# Altium schematic sheet DBL TLC5940 driver for High load - 5.3A MOSFET.SchDoc: DBL TLC5940 driver for High load - 5.3A MOSFET
size A4; Revision: 0; SheetNumber: 2; SheetTotal: 2; Version: 1.0; Variant: 5.3 A MOSFET; Modification: Mod; Project: Light Control
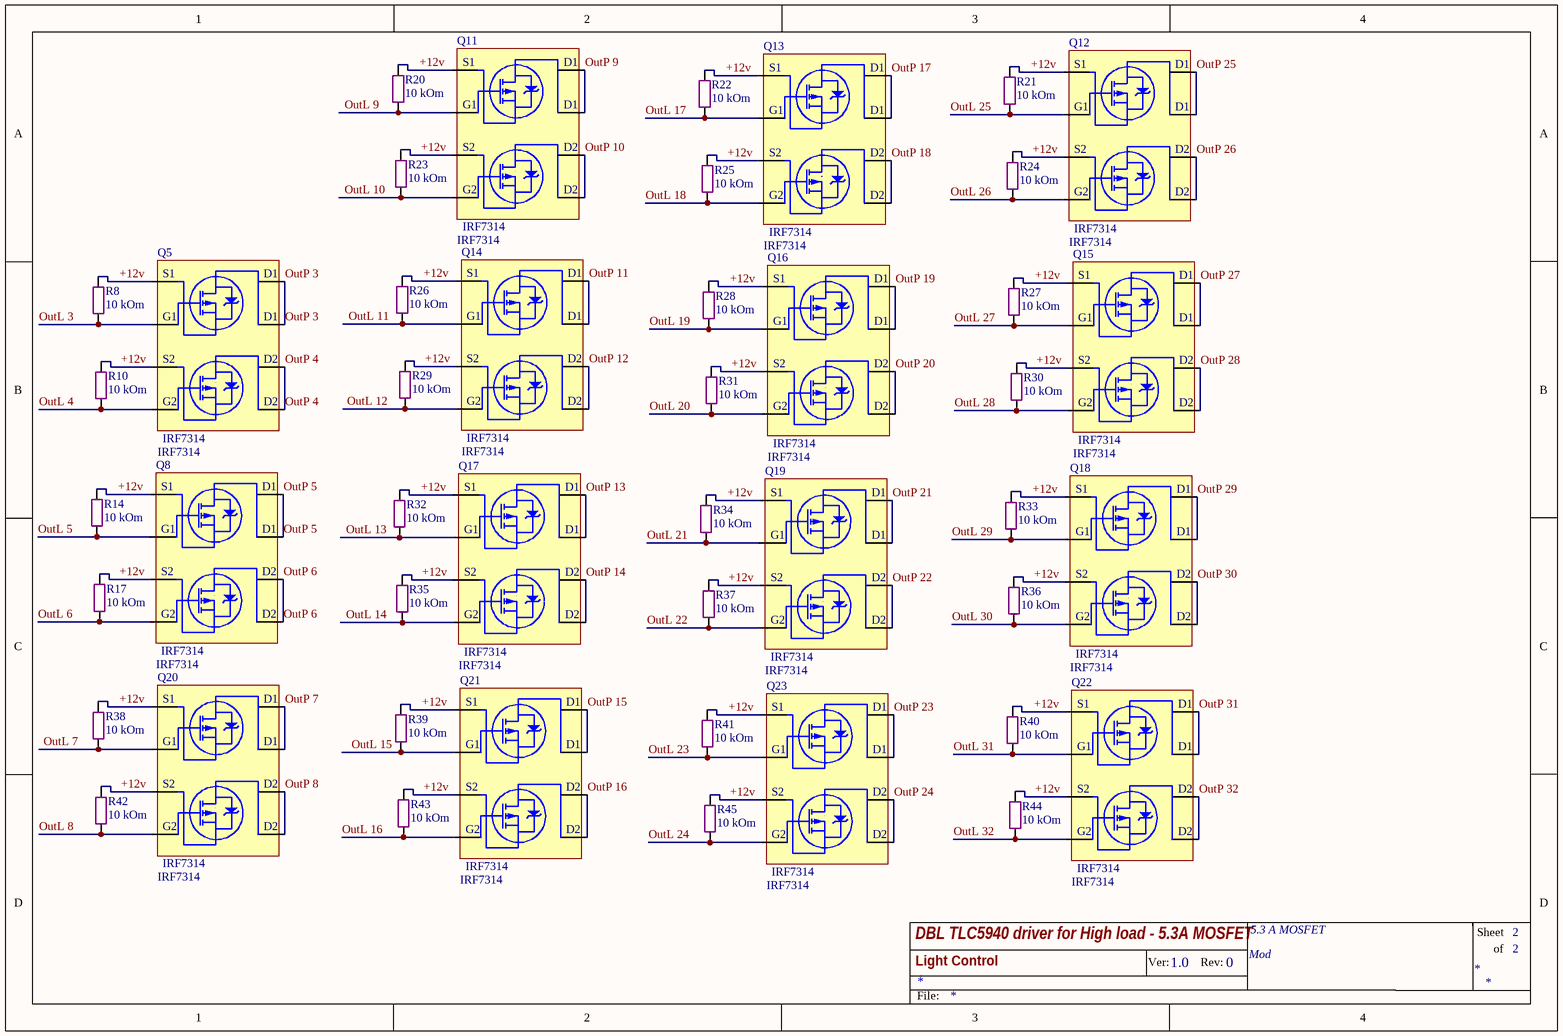
[diagram p0: DBL TLC5940 driver for High load - 5.3A MOSFET.SchDoc]

## Parts
Q5  IRF7314  [SO8]
Q8  IRF7314  [SO8]
Q11  IRF7314  [SO8]
Q12  IRF7314  [SO8]
Q13  IRF7314  [SO8]
Q14  IRF7314  [SO8]
Q15  IRF7314  [SO8]
Q16  IRF7314  [SO8]
Q17  IRF7314  [SO8]
Q18  IRF7314  [SO8]
Q19  IRF7314  [SO8]
Q20  IRF7314  [SO8]
Q21  IRF7314  [SO8]
Q22  IRF7314  [SO8]
Q23  IRF7314  [SO8]
R8  10 kOm  [SMD 0805 (2012)]
R10  10 kOm  [SMD 0805 (2012)]
R14  10 kOm  [SMD 0805 (2012)]
R17  10 kOm  [SMD 0805 (2012)]
R20  10 kOm  [SMD 0805 (2012)]
R21  10 kOm  [SMD 0805 (2012)]
R22  10 kOm  [SMD 0805 (2012)]
R23  10 kOm  [SMD 0805 (2012)]
R24  10 kOm  [SMD 0805 (2012)]
R25  10 kOm  [SMD 0805 (2012)]
R26  10 kOm  [SMD 0805 (2012)]
R27  10 kOm  [SMD 0805 (2012)]
R28  10 kOm  [SMD 0805 (2012)]
R29  10 kOm  [SMD 0805 (2012)]
R30  10 kOm  [SMD 0805 (2012)]
R31  10 kOm  [SMD 0805 (2012)]
R32  10 kOm  [SMD 0805 (2012)]
R33  10 kOm  [SMD 0805 (2012)]
R34  10 kOm  [SMD 0805 (2012)]
R35  10 kOm  [SMD 0805 (2012)]
R36  10 kOm  [SMD 0805 (2012)]
R37  10 kOm  [SMD 0805 (2012)]
R38  10 kOm  [SMD 0805 (2012)]
R39  10 kOm  [SMD 0805 (2012)]
R40  10 kOm  [SMD 0805 (2012)]
R41  10 kOm  [SMD 0805 (2012)]
R42  10 kOm  [SMD 0805 (2012)]
R43  10 kOm  [SMD 0805 (2012)]
R44  10 kOm  [SMD 0805 (2012)]
R45  10 kOm  [SMD 0805 (2012)]

## Nets
+12v: Q5.1(S) Q5.3(S) Q8.1(S) Q8.3(S) Q11.1(S) Q11.3(S) Q12.1(S) Q12.3(S) Q13.1(S) Q13.3(S) Q14.1(S) Q14.3(S) Q15.1(S) Q15.3(S) Q16.1(S) Q16.3(S) Q17.1(S) Q17.3(S) Q18.1(S) Q18.3(S) Q19.1(S) Q19.3(S) Q20.1(S) Q20.3(S) Q21.1(S) Q21.3(S) Q22.1(S) Q22.3(S) Q23.1(S) Q23.3(S) R8.2 R10.2 R14.2 R17.2 R20.2 R21.2 R22.2 R23.2 R24.2 R25.2 R26.2 R27.2 R28.2 R29.2 R30.2 R31.2 R32.2 R33.2 R34.2 R35.2 R36.2 R37.2 R38.2 R39.2 R40.2 R41.2 R42.2 R43.2 R44.2 R45.2
OutL 3: Q5.2(G) R8.1
OutL 4: Q5.4(G) R10.1
OutL 5: Q8.2(G) R14.1
OutL 6: Q8.4(G) R17.1
OutL 7: Q20.2(G) R38.1
OutL 8: Q20.4(G) R42.1
OutL 9: Q11.2(G) R20.1
OutL 10: Q11.4(G) R23.1
OutL 11: Q14.2(G) R26.1
OutL 12: Q14.4(G) R29.1
OutL 13: Q17.2(G) R32.1
OutL 14: Q17.4(G) R35.1
OutL 15: Q21.2(G) R39.1
OutL 16: Q21.4(G) R43.1
OutL 17: Q13.2(G) R22.1
OutL 18: Q13.4(G) R25.1
OutL 19: Q16.2(G) R28.1
OutL 20: Q16.4(G) R31.1
OutL 21: Q19.2(G) R34.1
OutL 22: Q19.4(G) R37.1
OutL 23: Q23.2(G) R41.1
OutL 24: Q23.4(G) R45.1
OutL 25: Q12.2(G) R21.1
OutL 26: Q12.4(G) R24.1
OutL 27: Q15.2(G) R27.1
OutL 28: Q15.4(G) R30.1
OutL 29: Q18.2(G) R33.1
OutL 30: Q18.4(G) R36.1
OutL 31: Q22.2(G) R40.1
OutL 32: Q22.4(G) R44.1
OutP 3: Q5.7(D) Q5.8(D)
OutP 4: Q5.5(D) Q5.6(D)
OutP 5: Q8.7(D) Q8.8(D)
OutP 6: Q8.5(D) Q8.6(D)
OutP 7: Q20.7(D) Q20.8(D)
OutP 8: Q20.5(D) Q20.6(D)
OutP 9: Q11.7(D) Q11.8(D)
OutP 10: Q11.5(D) Q11.6(D)
OutP 11: Q14.7(D) Q14.8(D)
OutP 12: Q14.5(D) Q14.6(D)
OutP 13: Q17.7(D) Q17.8(D)
OutP 14: Q17.5(D) Q17.6(D)
OutP 15: Q21.7(D) Q21.8(D)
OutP 16: Q21.5(D) Q21.6(D)
OutP 17: Q13.7(D) Q13.8(D)
OutP 18: Q13.5(D) Q13.6(D)
OutP 19: Q16.7(D) Q16.8(D)
OutP 20: Q16.5(D) Q16.6(D)
OutP 21: Q19.7(D) Q19.8(D)
OutP 22: Q19.5(D) Q19.6(D)
OutP 23: Q23.7(D) Q23.8(D)
OutP 24: Q23.5(D) Q23.6(D)
OutP 25: Q12.7(D) Q12.8(D)
OutP 26: Q12.5(D) Q12.6(D)
OutP 27: Q15.7(D) Q15.8(D)
OutP 28: Q15.5(D) Q15.6(D)
OutP 29: Q18.7(D) Q18.8(D)
OutP 30: Q18.5(D) Q18.6(D)
OutP 31: Q22.7(D) Q22.8(D)
OutP 32: Q22.5(D) Q22.6(D)

## Notes on the sheet
- Ver:
- Rev:
- Sheet
- of
- File:
- (in symbol IRF7314) S1; D1; G1; S2; D2; G2

## Library data of the parts
Q5 Q8 Q11-Q23 = IRF7314: Dual P-Ch  20V - 0.058Ω - 5.3A; Monufacturer: IOR; RDS Сопротивление Сток-Исток: 0.058 Om; I d - Drain current (continuous) at TC = 100°C: 4.3 A; VGS Порог Открытия: -0.7 V; VGS Макс напр на гейте: +-12 V; C ISS Входная емкость: 780 pF; C OSS Выходная емкость: 470 pF; V DSS (v): 20V; I d - Drain current (continuous) at TC = 25°C: 5.3 A; Name: IRF7314; Datasheet: http://tec.org.ru/_bd/2/277_IRF7314-IR.pdf; URL: http://tec.org.ru/board/49-1-0-277
R8 R10 R14 R17 R20-R45 = Res All Types